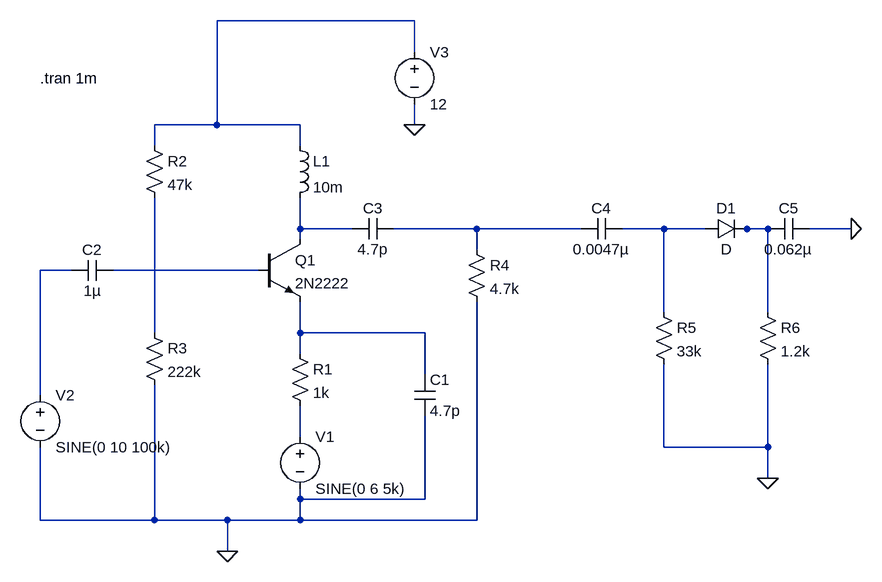
[diagram p0: schematic 18311a1930 AM.asc]
18311a1930 AM.asc, the LTspice schematic file:
Version 4
SHEET 1 1240 680
WIRE 448 -208 144 -208
WIRE 448 -160 448 -208
WIRE 144 -48 144 -208
WIRE 144 -48 48 -48
WIRE 272 -48 144 -48
WIRE 448 -48 448 -80
WIRE 48 -16 48 -48
WIRE 272 -16 272 -48
WIRE 272 112 272 64
WIRE 352 112 272 112
WIRE 544 112 416 112
WIRE 704 112 544 112
WIRE 832 112 768 112
WIRE 896 112 832 112
WIRE 960 112 944 112
WIRE 992 112 960 112
WIRE 1120 112 1056 112
WIRE 272 128 272 112
WIRE 544 144 544 112
WIRE -80 176 -128 176
WIRE 208 176 -16 176
WIRE 832 240 832 112
WIRE 992 240 992 112
WIRE 48 272 48 64
WIRE 272 272 272 224
WIRE 464 272 272 272
WIRE 272 304 272 272
WIRE 464 336 464 272
WIRE -128 368 -128 176
WIRE 272 432 272 384
WIRE 832 448 832 320
WIRE 992 448 992 320
WIRE 992 448 832 448
WIRE 992 496 992 448
WIRE 272 528 272 512
WIRE 464 528 464 400
WIRE 464 528 272 528
WIRE -128 560 -128 448
WIRE 48 560 48 352
WIRE 48 560 -128 560
WIRE 160 560 48 560
WIRE 272 560 272 528
WIRE 272 560 160 560
WIRE 544 560 544 224
WIRE 544 560 272 560
WIRE 160 608 160 560
FLAG 160 608 0
FLAG 448 -48 0
FLAG 992 496 0
FLAG 1120 112 0
SYMBOL npn 208 128 R0
SYMATTR InstName Q1
SYMATTR Value 2N2222
SYMBOL res 256 288 R0
SYMATTR InstName R1
SYMATTR Value 1k
SYMBOL voltage 272 416 R0
WINDOW 123 0 0 Left 0
WINDOW 39 0 0 Left 0
SYMATTR InstName V1
SYMATTR Value SINE(0 6 5k)
SYMBOL cap 448 336 R0
SYMATTR InstName C1
SYMATTR Value 4.7p
SYMBOL voltage -128 352 R0
WINDOW 123 0 0 Left 0
WINDOW 39 0 0 Left 0
SYMATTR InstName V2
SYMATTR Value SINE(0 10 100k)
SYMBOL ind 256 -32 R0
SYMATTR InstName L1
SYMATTR Value 10m
SYMBOL res 32 -32 R0
SYMATTR InstName R2
SYMATTR Value 47k
SYMBOL cap -16 160 R90
WINDOW 0 0 32 VBottom 2
WINDOW 3 32 32 VTop 2
SYMATTR InstName C2
SYMATTR Value 1µ
SYMBOL res 32 256 R0
SYMATTR InstName R3
SYMATTR Value 222k
SYMBOL voltage 448 -176 R0
WINDOW 123 0 0 Left 0
WINDOW 39 0 0 Left 0
SYMATTR InstName V3
SYMATTR Value 12
SYMBOL cap 416 96 R90
WINDOW 0 0 32 VBottom 2
WINDOW 3 32 32 VTop 2
SYMATTR InstName C3
SYMATTR Value 4.7p
SYMBOL res 528 128 R0
SYMATTR InstName R4
SYMATTR Value 4.7k
SYMBOL diode 896 128 R270
WINDOW 0 32 32 VTop 2
WINDOW 3 0 32 VBottom 2
SYMATTR InstName D1
SYMBOL cap 768 96 R90
WINDOW 0 0 32 VBottom 2
WINDOW 3 32 32 VTop 2
SYMATTR InstName C4
SYMATTR Value 0.0047µ
SYMBOL cap 1056 96 R90
WINDOW 0 0 32 VBottom 2
WINDOW 3 32 32 VTop 2
SYMATTR InstName C5
SYMATTR Value 0.062µ
SYMBOL res 816 224 R0
SYMATTR InstName R5
SYMATTR Value 33k
SYMBOL res 976 224 R0
SYMATTR InstName R6
SYMATTR Value 1.2k
TEXT -128 -120 Left 2 !.tran 1m

The netlist it stands for:
* 18311a1930 AM.asc
Q1 N002 N007 N009 0 2N2222
R1 N009 N010 1k
V1 N010 0 SINE(0 6 5k)
C1 N009 0 4.7p
V2 N006 0 SINE(0 10 100k)
L1 N001 N002 10m
R2 N001 N008 47k
C2 N007 N006 1µ
R3 N008 0 222k
V3 N001 0 12
C3 N003 N002 4.7p
R4 N003 0 4.7k
D1 N004 N005 D
C4 N004 N003 0.0047µ
C5 0 N005 0.062µ
R5 N004 0 33k
R6 N005 0 1.2k
.model D D
.lib standard.dio
.model NPN NPN
.model PNP PNP
.lib standard.bjt
.tran 1m
.backanno
.end